# EAGLE design 44-pin QFN+TQFP (EAGLE 6.3)
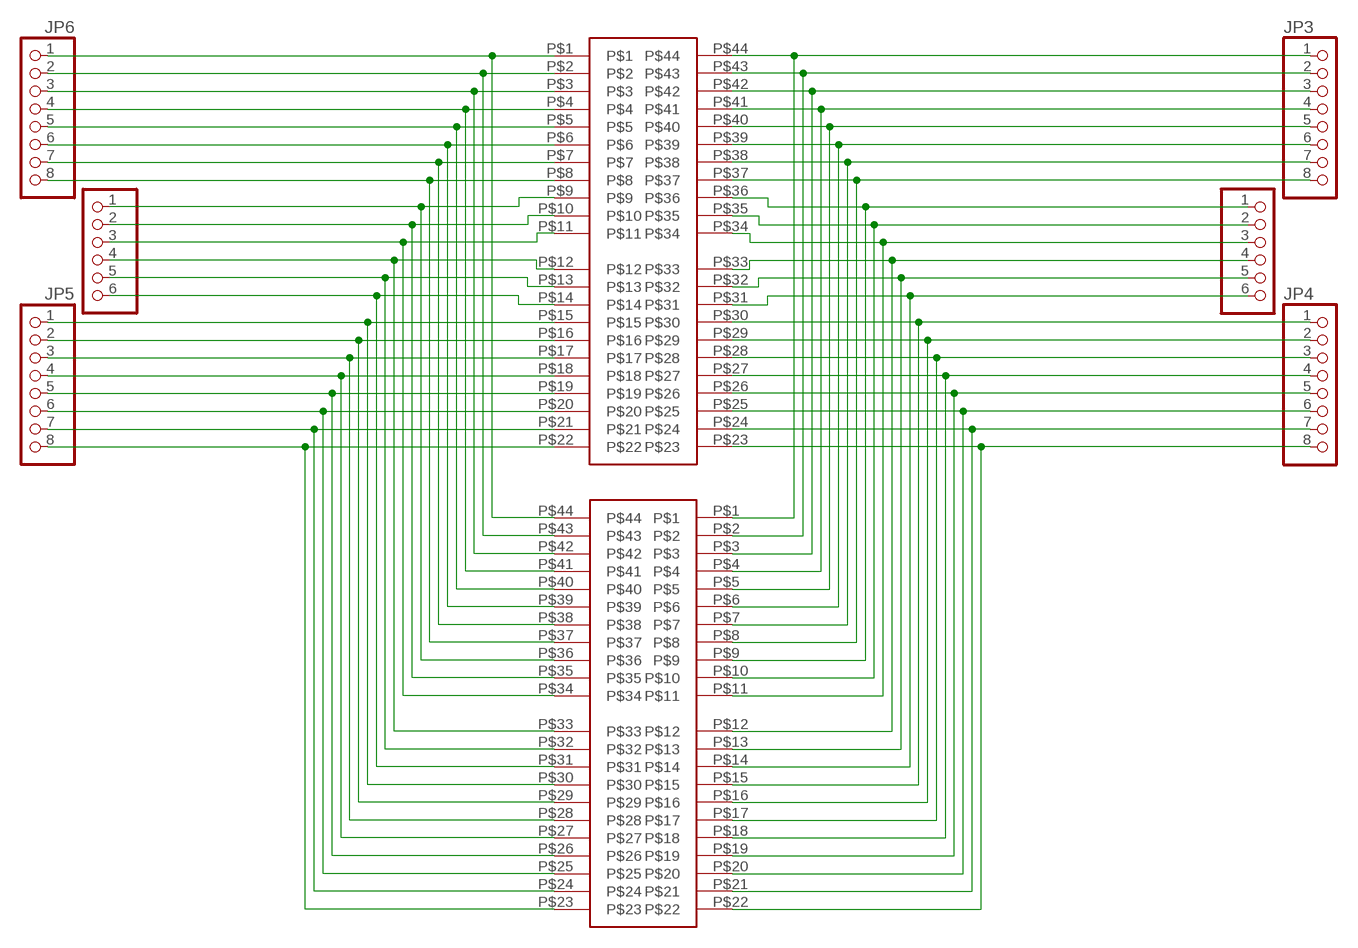
[diagram p0: schematic, sheet 1]

## Parts
JP1  PADS-6  [PADS-6]
JP2  PADS-6  [PADS-6]
JP3  PADS-8CLEANBIG  [PADS-8]
JP4  PADS-8CLEANBIG  [PADS-8]
JP5  PADS-8CLEANBIG  [PADS-8]
JP6  PADS-8CLEANBIG  [PADS-8]
U$1  44-PINQFN  [QFN44]
U$2  44-PINTQFP  [TQFP44]

## Nets
N$1: JP6.1 U$1.P$1 U$2.P$44
N$2: JP6.2 U$1.P$2 U$2.P$43
N$3: JP6.3 U$1.P$3 U$2.P$42
N$4: JP6.4 U$1.P$4 U$2.P$41
N$5: JP6.5 U$1.P$5 U$2.P$40
N$6: JP6.6 U$1.P$6 U$2.P$39
N$7: JP6.7 U$1.P$7 U$2.P$38
N$8: JP6.8 U$1.P$8 U$2.P$37
N$9: JP5.1 U$1.P$15 U$2.P$30
N$10: JP5.2 U$1.P$16 U$2.P$29
N$11: JP5.3 U$1.P$17 U$2.P$28
N$12: JP5.4 U$1.P$18 U$2.P$27
N$13: JP5.5 U$1.P$19 U$2.P$26
N$14: JP5.6 U$1.P$20 U$2.P$25
N$15: JP5.7 U$1.P$21 U$2.P$24
N$16: JP5.8 U$1.P$22 U$2.P$23
N$17: JP4.1 U$1.P$30 U$2.P$15
N$18: JP4.2 U$1.P$29 U$2.P$16
N$19: JP4.3 U$1.P$28 U$2.P$17
N$20: JP4.4 U$1.P$27 U$2.P$18
N$21: JP4.5 U$1.P$26 U$2.P$19
N$22: JP4.6 U$1.P$25 U$2.P$20
N$23: JP4.7 U$1.P$24 U$2.P$21
N$24: JP4.8 U$1.P$23 U$2.P$22
N$25: JP3.1 U$1.P$44 U$2.P$1
N$26: JP3.2 U$1.P$43 U$2.P$2
N$27: JP3.3 U$1.P$42 U$2.P$3
N$28: JP3.4 U$1.P$41 U$2.P$4
N$29: JP3.5 U$1.P$40 U$2.P$5
N$30: JP3.6 U$1.P$39 U$2.P$6
N$31: JP3.7 U$1.P$38 U$2.P$7
N$32: JP3.8 U$1.P$37 U$2.P$8
N$33: JP1.4 U$1.P$33 U$2.P$12
N$34: JP1.5 U$1.P$32 U$2.P$13
N$35: JP1.6 U$1.P$31 U$2.P$14
N$36: JP1.3 U$1.P$34 U$2.P$11
N$37: JP1.2 U$1.P$35 U$2.P$10
N$38: JP1.1 U$1.P$36 U$2.P$9
N$39: JP2.3 U$1.P$11 U$2.P$34
N$40: JP2.2 U$1.P$10 U$2.P$35
N$41: JP2.1 U$1.P$9 U$2.P$36
N$42: JP2.4 U$1.P$12 U$2.P$33
N$43: JP2.5 U$1.P$13 U$2.P$32
N$44: JP2.6 U$1.P$14 U$2.P$31

## Library data of the parts
JP1 JP2 = breakouts:PADS-6: PIN HEADER
JP3-JP6 = breakouts:PADS-8: PIN HEADER
U$1 U$2 = breakouts:44-PIN

## Board
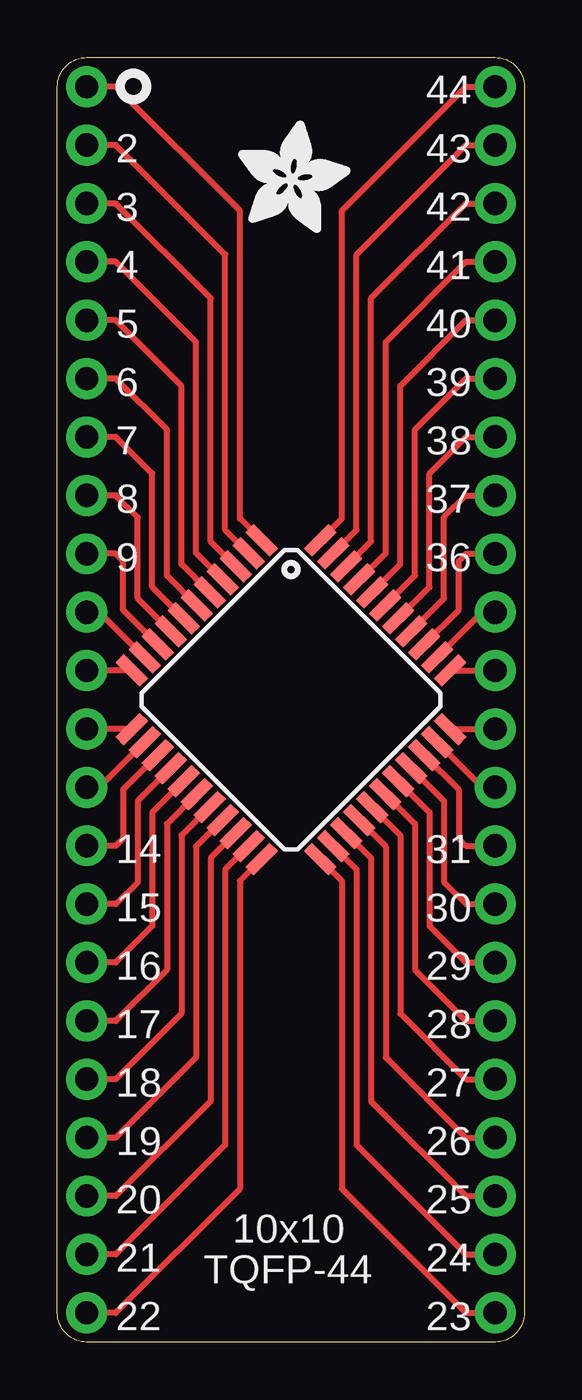
[diagram p1: board, top side]
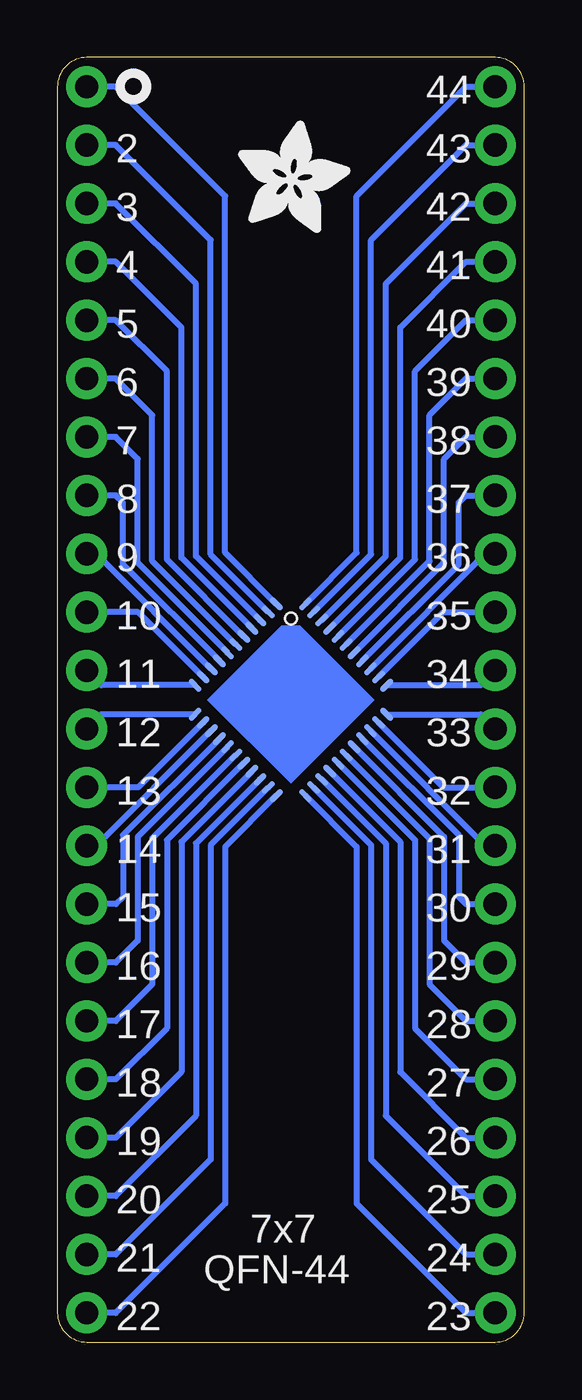
[diagram p2: board, bottom side, seen from below]

Size 20.32 x 55.88 mm. Coordinates in mm from the lower left corner, seen from the top.
Outline: 0,1.27 0,54.61 arc-90 1.27,55.88 19.05,55.88 arc-90 20.32,54.61 20.32,1.27 arc-90 19.05,0 1.27,0 arc-90 0,1.27
Copper layers (1*16): Top 0.035mm / dielectric 1.5mm / Bottom 0.035mm
Design rules "default": minimum track width 8mil, minimum drill 16mil, track to track 8mil, track to pad 8mil, pad to pad 8mil, via to via 8mil, smd to smd 8mil, copper to edge 10mil, drill to drill 8mil, minimum pad ring 10mil, minimum via ring 8mil, stop-mask expansion 4mil, vias tented up to drill 20mil, thermal gap 10mil

### Footprints (pad centres in the part's own frame; a part is rotated, then mirrored left to right if it is on the bottom)
PADS-6 = drill 1.016 pad 1.778: 1 -6.35,0; 2 -3.81,0; 3 -1.27,0; 4 1.27,0; 5 3.81,0; 6 6.35,0
PADS-8 = drill 1.016 pad 1.778: 1 -8.89,0; 2 -6.35,0; 3 -3.81,0; 4 -1.27,0; 5 1.27,0; 6 3.81,0; 7 6.35,0; 8 8.89,0
QFN44 = smd 0.25 x 0.7: P$1 -2.5,3.4; P$2 -2,3.4; P$3 -1.5,3.4; P$4 -1,3.4; P$5 -0.5,3.4; P$6 0,3.4; P$7 0.5,3.4; P$8 1,3.4; P$9 1.5,3.4; P$10 2,3.4; P$11 2.5,3.4; P$23 2.5,-3.4; P$24 2,-3.4; P$25 1.5,-3.4; P$26 1,-3.4; P$27 0.5,-3.4; P$28 0,-3.4; P$29 -0.5,-3.4; P$30 -1,-3.4; P$31 -1.5,-3.4; P$32 -2,-3.4; P$33 -2.5,-3.4 | smd 0.7 x 0.25: P$12 3.4,2.5; P$13 3.4,2; P$14 3.4,1.5; P$15 3.4,1; P$16 3.4,0.5; P$17 3.4,0; P$18 3.4,-0.5; P$19 3.4,-1; P$20 3.4,-1.5; P$21 3.4,-2; P$22 3.4,-2.5; P$34 -3.4,-2.5; P$35 -3.4,-2; P$36 -3.4,-1.5; P$37 -3.4,-1; P$38 -3.4,-0.5; P$39 -3.4,0; P$40 -3.4,0.5; P$41 -3.4,1; P$42 -3.4,1.5; P$43 -3.4,2; P$44 -3.4,2.5
TQFP44 = smd 0.5 x 1.5: P$1 -4,5.8; P$2 -3.2,5.8; P$3 -2.4,5.8; P$4 -1.6,5.8; P$5 -0.8,5.8; P$6 0,5.8; P$7 0.8,5.8; P$8 1.6,5.8; P$9 2.4,5.8; P$10 3.2,5.8; P$11 4,5.8; P$23 4,-5.8; P$24 3.2,-5.8; P$25 2.4,-5.8; P$26 1.6,-5.8; P$27 0.8,-5.8; P$28 0,-5.8; P$29 -0.8,-5.8; P$30 -1.6,-5.8; P$31 -2.4,-5.8; P$32 -3.2,-5.8; P$33 -4,-5.8 | smd 1.5 x 0.5: P$12 5.8,4; P$13 5.8,3.2; P$14 5.8,2.4; P$15 5.8,1.6; P$16 5.8,0.8; P$17 5.8,0; P$18 5.8,-0.8; P$19 5.8,-1.6; P$20 5.8,-2.4; P$21 5.8,-3.2; P$22 5.8,-4; P$34 -5.8,-4; P$35 -5.8,-3.2; P$36 -5.8,-2.4; P$37 -5.8,-1.6; P$38 -5.8,-0.8; P$39 -5.8,0; P$40 -5.8,0.8; P$41 -5.8,1.6; P$42 -5.8,2.4; P$43 -5.8,3.2; P$44 -5.8,4

### Placement (x,y rotation side)
JP1  19.05,27.94 270 top
JP2  1.27,27.94 270 top
JP3  19.05,45.72 270 top
JP4  19.05,10.16 270 top
JP5  1.27,10.16 270 top
JP6  1.27,45.72 270 top
U$1  10.16,27.94 315 bottom
U$2  10.16,27.94 315 top
U$3  [ADAFRUIT_5MM]  7.87,48.26 0 top
U$4  [ADAFRUIT_5MM]  12.45,48.26 0 bottom

### Tracks (layer width: path | path; a pad name or v marks a point on that pad's centre or on a via)
N$1
  Top 0.254: U$2.P$44 7.94,35.82 7.94,49.21 2.54,54.61 JP6.1
  Bottom 0.254: U$1.P$1 7.3,34.33 7.3,49.85 2.54,54.61 JP6.1
N$2
  Top 0.254: U$2.P$43 7.3,35.32 7.3,47.31 2.54,52.07 JP6.2
  Bottom 0.254: U$1.P$2 6.67,34.26 6.67,47.94 2.54,52.07 JP6.2
N$3
  Top 0.254: U$2.P$42 6.67,34.83 6.67,45.4 2.54,49.53 JP6.3
  Bottom 0.254: U$1.P$3 6.03,34.19 6.03,46.04 2.54,49.53 JP6.3
N$4
  Top 0.254: U$2.P$41 6.03,34.33 6.03,43.5 2.54,46.99 JP6.4
  Bottom 0.254: U$1.P$4 5.4,34.12 5.4,44.13 2.54,46.99 JP6.4
N$5
  Top 0.254: U$2.P$40 5.4,33.83 5.4,41.59 2.54,44.45 JP6.5
  Bottom 0.254: U$1.P$5 4.76,34.05 4.76,42.23 2.54,44.45 JP6.5
N$6
  Top 0.254: U$2.P$39 4.76,33.34 4.76,39.69 2.54,41.91 JP6.6
  Bottom 0.254: U$1.P$6 4.13,33.97 4.13,40.32 2.54,41.91 JP6.6
N$7
  Top 0.254: U$2.P$38 4.13,32.84 4.13,37.78 2.54,39.37 JP6.7
  Bottom 0.254: U$1.P$7 3.49,33.9 3.49,38.42 2.54,39.37 JP6.7
N$8
  Top 0.254: U$2.P$37 3.49,32.34 3.49,35.88 2.54,36.83 JP6.8
  Bottom 0.254: U$1.P$8 2.86,33.83 2.86,36.51 2.54,36.83 JP6.8
N$9
  Top 0.254: U$2.P$30 3.49,23.54 3.49,20 2.54,19.05 JP5.1
  Bottom 0.254: U$1.P$15 2.86,22.05 2.86,19.37 2.54,19.05 JP5.1
N$10
  Top 0.254: U$2.P$29 4.13,23.04 4.13,18.1 2.54,16.51 JP5.2
  Bottom 0.254: U$1.P$16 3.49,21.98 3.49,17.46 2.54,16.51 JP5.2
N$11
  Top 0.254: U$2.P$28 4.76,22.54 4.76,16.19 2.54,13.97 JP5.3
  Bottom 0.254: U$1.P$17 4.13,21.91 4.13,15.56 2.54,13.97 JP5.3
N$12
  Top 0.254: U$2.P$27 5.4,22.05 5.4,14.29 2.54,11.43 JP5.4
  Bottom 0.254: U$1.P$18 4.76,21.84 4.76,13.65 2.54,11.43 JP5.4
N$13
  Top 0.254: U$2.P$26 6.03,21.55 6.03,12.38 2.54,8.89 JP5.5
  Bottom 0.254: U$1.P$19 5.4,21.76 5.4,11.75 2.54,8.89 JP5.5
N$14
  Top 0.254: U$2.P$25 6.67,21.05 6.67,10.48 2.54,6.35 JP5.6
  Bottom 0.254: U$1.P$20 6.03,21.69 6.03,9.84 2.54,6.35 JP5.6
N$15
  Top 0.254: U$2.P$24 7.3,20.56 7.3,8.57 2.54,3.81 JP5.7
  Bottom 0.254: U$1.P$21 6.67,21.62 6.67,7.94 2.54,3.81 JP5.7
N$16
  Top 0.254: U$2.P$23 7.94,20.06 7.94,6.67 2.54,1.27 JP5.8
  Bottom 0.254: U$1.P$22 7.3,21.55 7.3,6.03 2.54,1.27 JP5.8
N$17
  Top 0.254: U$2.P$15 16.83,23.54 16.83,20 17.78,19.05 JP4.1
  Bottom 0.254: U$1.P$30 17.46,22.05 17.46,19.37 17.78,19.05 JP4.1
N$18
  Top 0.254: U$2.P$16 16.19,23.04 16.19,18.1 17.78,16.51 JP4.2
  Bottom 0.254: U$1.P$29 16.83,21.98 16.83,17.46 17.78,16.51 JP4.2
N$19
  Top 0.254: U$2.P$17 15.56,22.54 15.56,16.19 17.78,13.97 JP4.3
  Bottom 0.254: U$1.P$28 16.19,21.91 16.19,15.56 17.78,13.97 JP4.3
N$20
  Top 0.254: U$2.P$18 14.92,22.05 14.92,14.29 17.78,11.43 JP4.4
  Bottom 0.254: U$1.P$27 15.56,21.84 15.56,13.65 17.78,11.43 JP4.4
N$21
  Top 0.254: U$2.P$19 14.29,21.55 14.29,12.38 17.78,8.89 JP4.5
  Bottom 0.254: U$1.P$26 14.92,21.76 14.92,11.75 17.78,8.89 JP4.5
N$22
  Top 0.254: U$2.P$20 13.65,21.05 13.65,10.48 17.78,6.35 JP4.6
  Bottom 0.254: U$1.P$25 14.29,21.69 14.29,9.84 17.78,6.35 JP4.6
N$23
  Top 0.254: U$2.P$21 13.02,20.56 13.02,8.57 17.78,3.81 JP4.7
  Bottom 0.254: U$1.P$24 13.65,21.62 13.65,7.94 17.78,3.81 JP4.7
N$24
  Top 0.254: U$2.P$22 12.38,20.06 12.38,6.67 17.78,1.27 JP4.8
  Bottom 0.254: U$1.P$23 13.02,21.55 13.02,6.03 17.78,1.27 JP4.8
N$25
  Top 0.254: U$2.P$1 12.38,35.82 12.38,49.21 17.78,54.61 JP3.1
  Bottom 0.254: U$1.P$44 13.02,34.33 13.02,49.85 17.78,54.61 JP3.1
N$26
  Top 0.254: U$2.P$2 13.02,35.32 13.02,47.31 17.78,52.07 JP3.2
  Bottom 0.254: U$1.P$43 13.65,34.26 13.65,47.94 17.78,52.07 JP3.2
N$27
  Top 0.254: U$2.P$3 13.65,34.83 13.65,45.4 17.78,49.53 JP3.3
  Bottom 0.254: U$1.P$42 14.29,34.19 14.29,46.04 17.78,49.53 JP3.3
N$28
  Top 0.254: U$2.P$4 14.29,34.33 14.29,43.5 17.78,46.99 JP3.4
  Bottom 0.254: U$1.P$41 14.92,34.12 14.92,44.13 17.78,46.99 JP3.4
N$29
  Top 0.254: U$2.P$5 14.92,33.83 14.92,41.59 17.78,44.45 JP3.5
  Bottom 0.254: U$1.P$40 15.56,34.05 15.56,42.23 17.78,44.45 JP3.5
N$30
  Top 0.254: U$2.P$6 15.56,33.34 15.56,39.69 17.78,41.91 JP3.6
  Bottom 0.254: U$1.P$39 16.19,33.97 16.19,40.32 17.78,41.91 JP3.6
N$31
  Top 0.254: U$2.P$7 16.19,32.84 16.19,37.78 17.78,39.37 JP3.7
  Bottom 0.254: U$1.P$38 16.83,33.9 16.83,38.42 17.78,39.37 JP3.7
N$32
  Top 0.254: U$2.P$8 16.83,32.34 16.83,35.88 17.78,36.83 JP3.8
  Bottom 0.254: U$1.P$37 17.46,33.83 17.46,36.51 17.78,36.83 JP3.8
N$33
  Top 0.254: U$2.P$12 JP1.4
  Bottom 0.254: U$1.P$33 18.42,27.3 JP1.4
N$34
  Top 0.254: U$2.P$13 18.5,24.13 JP1.5
  Bottom 0.254: U$1.P$32 16.8,24.13 JP1.5
N$35
  Top 0.254: U$2.P$14 17.46,24.03 17.46,21.91 17.78,21.59 JP1.6
  Bottom 0.254: U$1.P$31 18.63,21.59 JP1.6
N$36
  Top 0.254: U$2.P$11 JP1.3
  Bottom 0.254: U$1.P$34 18.42,28.58 JP1.3
N$37
  Top 0.254: U$2.P$10 18.5,31.75 JP1.2
  Bottom 0.254: U$1.P$35 16.8,31.75 JP1.2
N$38
  Top 0.254: U$2.P$9 17.46,31.85 17.46,33.97 17.78,34.29 JP1.1
  Bottom 0.254: U$1.P$36 18.63,34.29 JP1.1
N$39
  Top 0.254: U$2.P$34 JP2.3
  Bottom 0.254: U$1.P$11 1.9,28.58 JP2.3
N$40
  Top 0.254: U$2.P$35 1.82,31.75 JP2.2
  Bottom 0.254: U$1.P$10 3.52,31.75 JP2.2
N$41
  Top 0.254: U$2.P$36 2.86,31.85 2.86,33.97 2.54,34.29 JP2.1
  Bottom 0.254: U$1.P$9 1.69,34.29 JP2.1
N$42
  Top 0.254: U$2.P$33 JP2.4
  Bottom 0.254: U$1.P$12 1.9,27.3 JP2.4
N$43
  Top 0.254: U$2.P$32 1.82,24.13 JP2.5
  Bottom 0.254: U$1.P$13 3.52,24.13 JP2.5
N$44
  Top 0.254: U$2.P$31 2.86,24.03 2.86,21.91 2.54,21.59 JP2.6
  Bottom 0.254: U$1.P$14 1.69,21.59 JP2.6

### Text on the board
tPlace: 44 | 43 | 2 | 42 | 3 | 41 | 4 | 40 | 5 | 39 | 6 | 38 | 7 | 37 | 8 | 36 | 9 | 31 | 14 | 30 | 15 | 29 | 16 | 28 | 17 | 27 | 18 | 26 | 19 | 25 | 20 | 10x10 | 24 | 21 | TQFP-44 | 23 | 22
bPlace: 44 | 43 | 2 | 42 | 3 | 41 | 4 | 40 | 5 | 39 | 6 | 38 | 7 | 37 | 8 | 36 | 9 | 35 | 10 | 34 | 11 | 33 | 12 | 32 | 13 | 31 | 14 | 30 | 15 | 29 | 16 | 28 | 17 | 27 | 18 | 26 | 19 | 25 | 20 | 24 | 7x7 | QFN-44 | 21 | 23 | 22